# Altium project STCFocusRemote_Reciever.PrjPcb
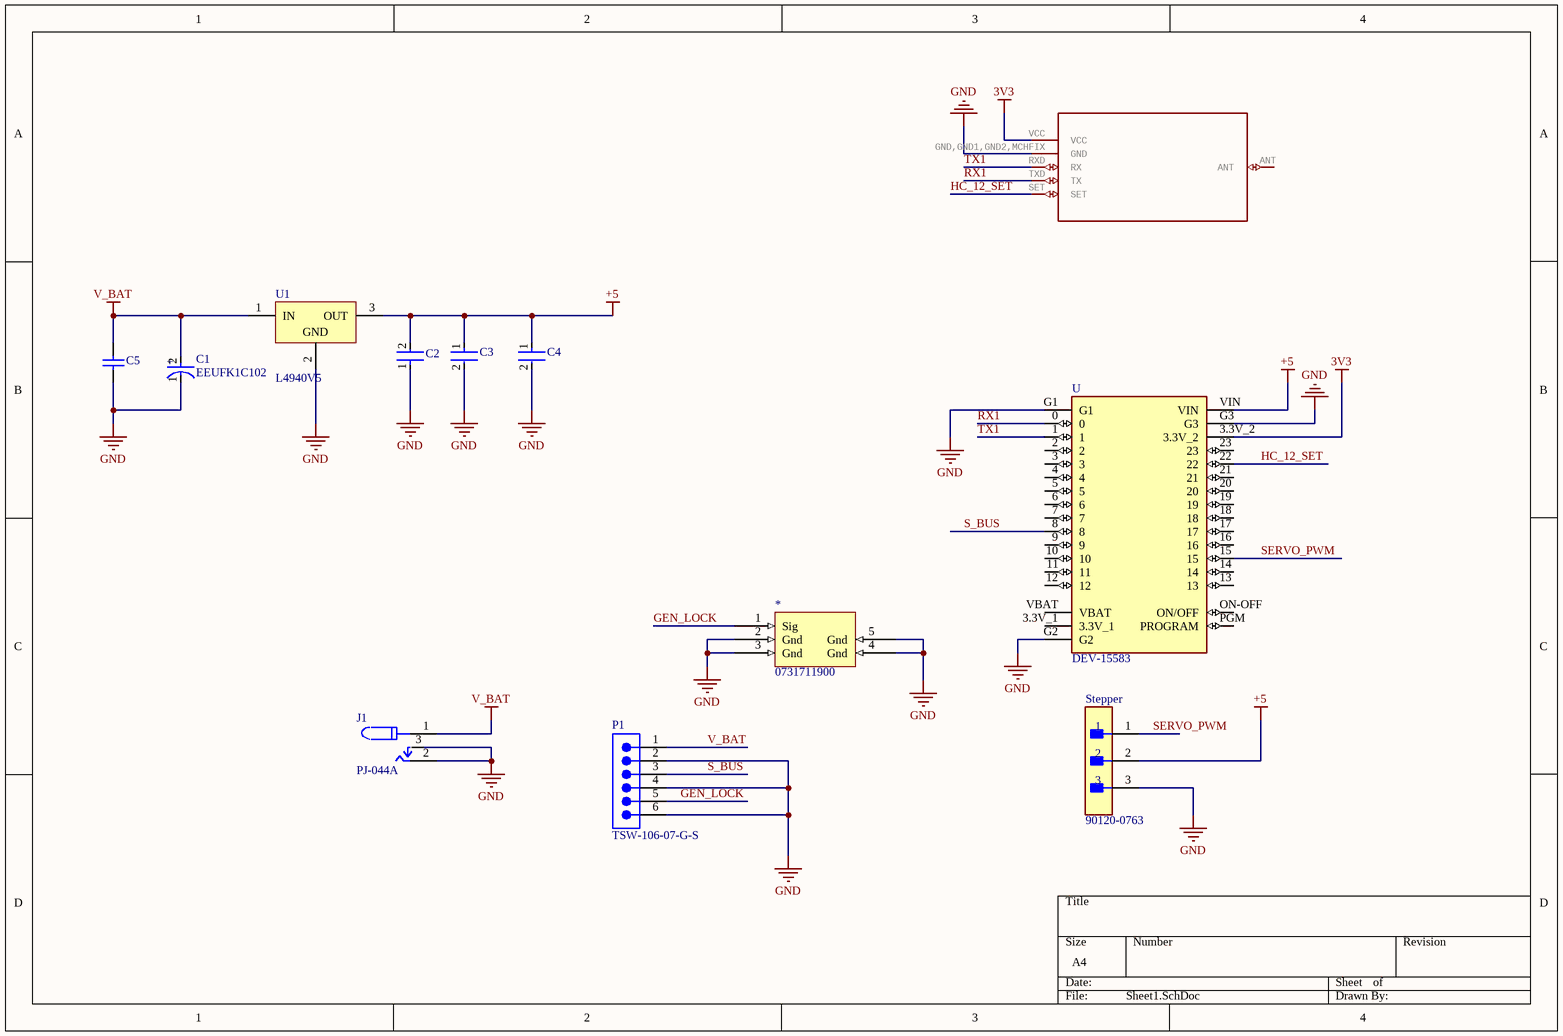
[diagram p0: Sheet1.SchDoc]
1 sheet, 12 parts. Net scope: global (net labels, ports and power ports of the same name join across sheets).
Board file: Receiver.PcbDoc

## Sheet Sheet1.SchDoc
size A4; SheetNumber: 1; SheetTotal: 1

### Parts
1  HC-12 433MHz module footprint   MCHFIX is for mechanical fix pin which is NC but on this file connected to GND   https://github.com/meendiz/hc-12_si4463/  [HC-12_FOOTPRINT]  (value not drawn)
*  0731711900  [0731711900-Footprint-1]
C1  EEUFK1C102  [FP-RAD-TH-D_10_0_5-L_16_1-MFG]
C2  C0805C106K8PACTU  [FP-C0805C-DG-MFG]  (value not drawn)
C3  C0805C106K8PACTU  [FP-C0805C-DG-MFG]  (value not drawn)
C4  C0805C106K8PACTU  [FP-C0805C-DG-MFG]  (value not drawn)
C5  GRM21BR71H104KA01L  [CAPC2013X135X45ML10T25]  (value not drawn)
J1  PJ-044A  [FP-PJ-044A-MFG]
P1  TSW-106-07-G-S  [SMTC-TSW-106-07-X-S]
Stepper  90120-0763  [FP-90120-0763-MFG]
U  DEV-15583  [MODULE_DEV-15583]
U1  L4940V5  [TO220]

### Nets
3V3: 1.VCC U.3.3V_2
+5: C2.2 C3.1 C4.1 Stepper.2 U.VIN U1.3(OUT)
GND: 1.GND,GND1,GND2,MCHFIX(GND) *.2(Gnd) *.3(Gnd) *.4(Gnd) *.5(Gnd) C1.1(C) C2.1 C3.2 C4.2 C5.2 J1.2 J1.3 P1.2 P1.4 P1.6 Stepper.3 U.G1 U.G2 U.G3 U1.2(GND)
V_BAT: C1.2(A) C5.1 J1.1 P1.1 U1.1(IN)
GEN_LOCK: *.1(Sig) P1.5
HC_12_SET: 1.SET U.22
RX1: 1.TXD(TX) U.0
S_BUS: P1.3 U.8
SERVO_PWM: Stepper.1 U.15
TX1: 1.RXD(RX) U.1

Not connected (* = marked no-connect by the designer): 1 ANT; U 2 3 3.3V_1 4 5 6 7 9 10 11 12 13 14 16 17 18 19 20 21 23 ON-OFF(ON/OFF) PGM(PROGRAM) VBAT

### Notes on the sheet
- (in symbol CMP-05427-001094-1) +

### Library data of the parts
1 = HC-12_FOOTPRINT: GateName_1: G$1; SymbolName_1: HC-12_FOOTPRINT; LibraryName: hc12_433mhz; DeviceSetName: HC-12_FOOTPRINT; Package: HC-12_FOOTPRINT
* = CMP-002-00075-1: Rf Coax Conn, Bnc, Jack, 75 Ohm, Pcb
C1 = CMP-05427-001094-1: Aluminum Electrolytic Capacitors (Radial Lead Type) AEC-Q200 Qualified 1000uF ±20% 16V; Dielectric Material: Aluminium; Capacitance: 1mF; Ripple Current: 1.24A; Life (Hours): 4000Hour; Lead Diameter: 0.6mm; Impedance: 49mR; Case/Package: Radial; Max Operating Temperature: 105°C; Diameter: 10mm; Termination: Radial; Series: FK Radial; REACH SVHC: No SVHC; Voltage: 16V; Tolerance: 20%; Min Operating Temperature: -55°C; Packaging: Bulk; Mount: Through Hole; Radiation Hardening: No; Construction: RADIAL; Height: 16mm; RoHS Compliant: Yes; Voltage Rating (DC): 16V; Lead Pitch: 5mm; Number of Pins: 2; Voltage Rating: 16V
C2-C4 = CMP-2007-03243-2: CAP CER 10UF 10V X5R 0805; Manufacturer: Kemet; 3DS Part Number: 220-00001; Tolerance: 10%; Description: SMD Comm X5R, Ceramic, 10 uF, 10%, 10 V, X5R, SMD, MLCC, Temperature Stable, Class II, 0805; Temperature Coefficient: 15%; Material: Ceramic; Device Class L2: Capacitors; Device Class L1: Passive Components; ComponentLink2URL: https://content.kemet.com/datasheets/KEM_C1006_X5R_SMD.pdf; Height: 1.4mm; Lead Free: Yes; Manufacturer Part Number: C0805C106K8PACTU; Digikey Description: CAP CER 10UF 10V X5R 0805; Octopart: https://octopart.com/c0805c106k8pactu-kemet-98697; Capacitance: 10uF; Value: 10uF; Temperature Range Low: -55°C; Temperature: -55°C to +85°C; Automotive: No; Mouser Description: CAP CER 10UF 10V X5R 0805; Ipc Land Pattern Name: CAPC200125X125; Temperature Range High: +85°C; Voltage: 10V; RoHS: TRUE; Device Class L3: Ceramic Capacitors; ComponentLink2Description: Datasheet; Voltage Rating: 10V; Package: C0805C-DG; Temperature Characteristic: X5R; Category: Cap
C5 = CMP-2100-03644-1: Chip Capacitor, 0.1 uF, +/- 10%, 50 V, -55 to 125 degC, 0805 (2012 Metric), RoHS, Tape and Reel; Manufacturer: Murata; Voltage: 50V; Capacitance: 100nF; Insulation Resistance: 10GR; Dielectric Material: Ceramic; Dielectric: X7R; Package Description: 2-Pin Surface Mount Device, Body 2 x 1.25 mm; Manufacturer URL: http://www.murata.com/; Case Code (Imperial): 0805; Datasheet URL: http://psearch.en.murata.com/capacitor/product/GRM21BR71H104KA01%23.pdf; Termination: SMD/SMT; Lead Free: LeadFree; Package Quantity: 1; Mount: SurfaceMount; REACH SVHC: Unknown; Thickness: 0.053inch; Height: 1.25mm; Case/Package: 0805; Voltage Rating: 50V; Width: 0.049inch; Case Code (Metric): 2012; Material: Ceramic; Min Operating Temperature: -55degC; RoHSCompliant: true; Datasheet Version: 42675.0; Voltage Rating (DC): 50V; Tolerance: 10%; Package Reference: 0805; Depth: 1.25mm; Length: 2mm; Max Operating Temperature: 125degC; Packaging: TapeandReel; Number of Pins: 2; Radiation Hardening: No
J1 = CMP-14830-000003-1: CONN PWR JACK 2X5.5MM SOLDER; Manufacturer: CUI Inc; Description: 2 x 6.5 mm, 2.5 A, Vertical, Through Hole, Dc Power Jack Connector; Number Of Contacts: 3; Conn Orientation: Vertical; Standoff Height: 0.4mm; Voltage Rating: 24V; Current Rating: 2.5A; Conn Gender: Male; Temperature: -25°C to +85°C; Mouser Description: 2.0 mm Center Pin, 2.5 A, Vertical, Through Hole, Dc Power Jack Connector; Temperature Range High: +85°C; Manufacturer Part Number: PJ-044A; Digikey Description: CONN PWR JACK 2X5.5MM SOLDER; Device Class L1: Connectors; Lead Free: Yes; Height: 14.4mm; Package: PJ-044A; Temperature Range Low: -25°C; Octopart: https://octopart.com/pj-044a-cui-19052775; Device Class L2: Power Connectors; RoHS: TRUE; Category: Conn; ComponentLink2Description: Datasheet; Contact Material: Tin,Nickel; ComponentLink2URL: https://www.cui.com/product/resource/pj-044a.pdf; Device Class L3: unset; Automotive: No
P1 = CMP-1024-00383-1: 0.025" SQ Post Header, Through-hole, Vertical, -55 to 125 degC, 2.54 mm Pitch, 6-Pin, Male, RoHS; Manufacturer: Samtec; Pitch: 2.54 mm; RoHS: True; ComponentLink1Description: Manufacturer URL; DatasheetVersion: F-214; Orientation: Vertical; ComponentLink1URL: http://www.samtec.com; ComponentLink3Description: Package Specification; ComponentLink2Description: Datasheet; PackageVersion: DM, 8/1988; PackageDescription: .025[0.64] SQ. Post Terminal Strip Assembly; PackageReference: TSW-106-07-X-S; Mounting Technology: Through-hole; Temperature Range: -55 to 125 degC; ComponentLink3URL: http://www.samtec.com/documents/webfiles/cpdf/TSW-XXX-XX-XXX-X-XX-XXX-MKT.pdf; ComponentLink2URL: http://www.samtec.com/documents/webfiles/pdf/TSW_TH.PDF; PartNumber: TSW-106-07-G-S
Stepper = CMP-04776-000084-1: CONN HEADER VERT 3POS 2.54MM; Manufacturer: Molex; Voltage Rating: 350V; Number Of Contacts: 3; Conn Orientation: Vertical; Current Rating: 3A; Conn Gender: Male; Description: Board-To-Board Connector, C-Grid III 90120 Series, Through Hole, Header, 3, 2.54 mm; Package: 90120-0763; ComponentLink2Description: Datasheet; Height: 5.8mm; Manufacturer Part Number: 90120-0763; Temperature Range High: +125°C; RoHS: TRUE; ComponentLink2URL: https://www.molex.com/webdocs/datasheets/pdf/en-us/0901200763_PCB_HEADERS.pdf; Device Class L2: Headers and Wire Housings; Temperature: -55°C to +125°C; Device Class L1: Connectors; Pitch: 2.54mm; Footprint Url: https://www.molex.com/pdm_docs/sd/901200763_sd.pdf; Device Class L3: unset; Temperature Range Low: -55°C; Number Of Rows: 1; Category: Conn; Lead Free: Yes; Mouser Description: Board-To-Board Connector, C-Grid III 90120 Series, Through Hole, Header, 3, 2.54 mm; Octopart: https://octopart.com/90120-0763-molex-655433; Contact Material: Gold,Nickel; Automotive: No; Digikey Description: CONN HEADER VERT 3POS 2.54MM
U = DEV-15583: RT1062 Teensy 4.0 i.MX ARMÂ® CortexÂ®-M7 MPU Embedded Evaluation Board; MF: SparkFun Electronics; Value: *; Package: None; Digi-Key_Part_Number: 1568-DEV-15583-ND; Digi-Key_Purchase_URL: https://www.digikey.com/product-detail/en/sparkfun-electronics/DEV-15583/1568-DEV-15583-ND/10384551?utm_source=snapeda&utm_medium=aggregator&utm_campaign=symbol; MP: DEV-15583; SnapEDA_Link: https://www.snapeda.com/parts/DEV-15583/SparkFun%20Electronics/view-part/4001229/?ref=snap
U1 = CMP-0244-00429-1: 1.5A Very Low Drop Regulator, 3-Pin TO-220; PackageReference: TO220; PackageDescription: TO, Thru-Hole, Vertical, Heatsink Mounted; 3 In-Line Leads; Pitch 2.54 mm; ComponentLink1Description: Manufacturer URL; ComponentLink1URL: http://www.st.com; ComponentLink2Description: Datasheet; DatasheetVersion: 16/12/2009; ComponentLink2URL: http://www.st.com/internet/com/TECHNICAL_RESOURCES/TECHNICAL_LITERATURE/DATASHEET/CD00000442.pdf; ComponentLink3URL: http://www.st.com/internet/com/TECHNICAL_RESOURCES/TECHNICAL_LITERATURE/PACKAGE_INFORMATION/CD00004649.pdf; PackageVersion: ver3.0; ComponentLink3Description: Package Specification